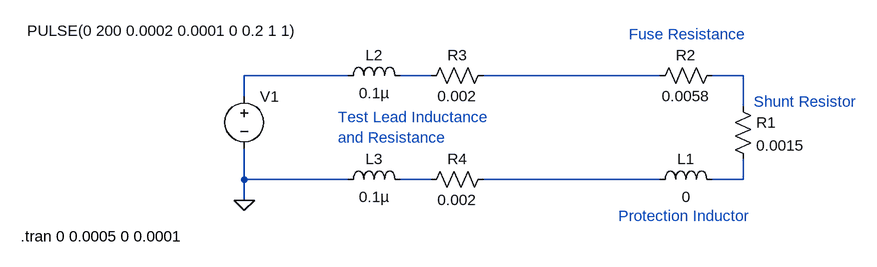
[diagram p0: schematic FuseModel.asc]
FuseModel.asc, the LTspice schematic file:
Version 4
SHEET 1 880 680
WIRE -64 48 -224 48
WIRE 64 48 16 48
WIRE 416 48 144 48
WIRE 544 48 496 48
WIRE -224 80 -224 48
WIRE 544 96 544 48
WIRE -224 208 -224 160
WIRE -64 208 -224 208
WIRE 64 208 16 208
WIRE 416 208 144 208
WIRE 544 208 544 176
WIRE 544 208 496 208
WIRE -224 240 -224 208
FLAG -224 240 0
SYMBOL res 528 80 R0
SYMATTR InstName R1
SYMATTR Value 0.0015
SYMATTR SpiceLine tol=0.1 pwr=3
SYMBOL ind 400 224 R270
WINDOW 0 32 56 VTop 2
WINDOW 3 5 56 VBottom 2
SYMATTR InstName L1
SYMATTR Value 0
SYMATTR SpiceLine Rser=0 Rpar=0 Cpar=0
SYMBOL res 512 32 R90
WINDOW 0 0 56 VBottom 2
WINDOW 3 32 56 VTop 2
SYMATTR InstName R2
SYMATTR Value 0.0058
SYMBOL ind -80 64 R270
WINDOW 0 32 56 VTop 2
WINDOW 3 5 56 VBottom 2
SYMATTR InstName L2
SYMATTR Value 0.1µ
SYMATTR SpiceLine Rser=0 Rpar=0 Cpar=0
SYMBOL ind -80 224 R270
WINDOW 0 32 56 VTop 2
WINDOW 3 5 56 VBottom 2
SYMATTR InstName L3
SYMATTR Value 0.1µ
SYMATTR SpiceLine Rser=0 Rpar=0 Cpar=0
SYMBOL res 160 32 R90
WINDOW 0 0 56 VBottom 2
WINDOW 3 32 56 VTop 2
SYMATTR InstName R3
SYMATTR Value 0.002
SYMBOL res 160 192 R90
WINDOW 0 0 56 VBottom 2
WINDOW 3 32 56 VTop 2
SYMATTR InstName R4
SYMATTR Value 0.002
SYMBOL voltage -224 64 R0
WINDOW 3 -334 -85 Left 2
SYMATTR Value PULSE(0 200 0.0002 0.0001 0 0.2 1 1)
SYMATTR InstName V1
SYMATTR Value2 AC 0 0
SYMATTR SpiceLine Rser=0 Cpar=0
TEXT -80 112 Left 2 ;Test Lead Inductance\nand Resistance
TEXT 368 -16 Left 2 ;Fuse Resistance
TEXT 560 88 Left 2 ;Shunt Resistor
TEXT 352 264 Left 2 ;Protection Inductor
TEXT -568 296 Left 2 !.tran 0 0.0005 0 0.0001

The netlist it stands for:
* FuseModel.asc
R1 N004 N007 0.0015 tol=0.1 pwr=3
L1 N006 N007 0 Rser=0 Rpar=0 Cpar=0
R2 N004 N003 0.0058
L2 N001 N002 0.1µ Rser=0 Rpar=0 Cpar=0
L3 0 N005 0.1µ Rser=0 Rpar=0 Cpar=0
R3 N003 N002 0.002
R4 N006 N005 0.002
V1 N001 0 PULSE(0 200 0.0002 0.0001 0 0.2 1 1) AC 0 0 Rser=0 Cpar=0
* Test Lead Inductance
* and Resistance
* Fuse Resistance
* Shunt Resistor
* Protection Inductor
.tran 0 0.0005 0 0.0001
.backanno
.end